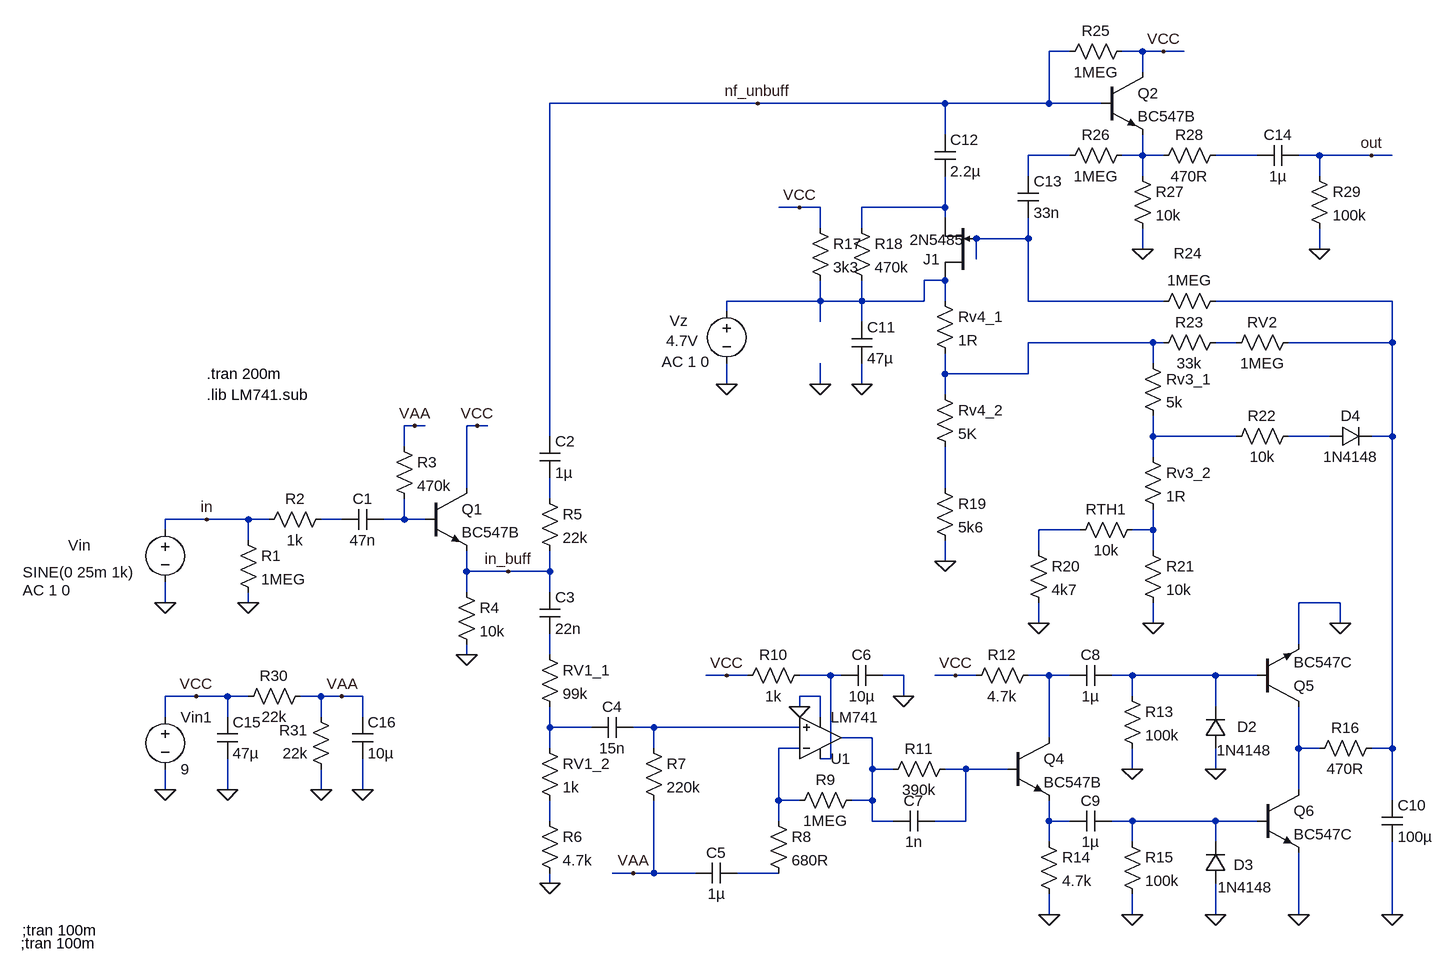
[diagram p0: schematic NF-1.asc]
NF-1.asc, the LTspice schematic file:
Version 4
SHEET 1 1268 920
WIRE 640 -496 608 -496
WIRE 752 -496 720 -496
WIRE 784 -496 752 -496
WIRE 816 -496 784 -496
WIRE 752 -464 752 -496
WIRE 160 -416 -160 -416
WIRE 448 -416 160 -416
WIRE 608 -416 608 -496
WIRE 608 -416 448 -416
WIRE 688 -416 608 -416
WIRE 448 -368 448 -416
WIRE 640 -336 576 -336
WIRE 752 -336 752 -368
WIRE 752 -336 720 -336
WIRE 784 -336 752 -336
WIRE 928 -336 864 -336
WIRE 1024 -336 992 -336
WIRE 1104 -336 1024 -336
WIRE 1136 -336 1104 -336
WIRE 576 -304 576 -336
WIRE 752 -304 752 -336
WIRE 1024 -304 1024 -336
WIRE 224 -256 192 -256
WIRE 256 -256 224 -256
WIRE 448 -256 448 -304
WIRE 448 -256 320 -256
WIRE 448 -240 448 -256
WIRE 256 -224 256 -256
WIRE 320 -224 320 -256
WIRE 576 -208 576 -240
WIRE 576 -208 496 -208
WIRE 752 -192 752 -224
WIRE 1024 -192 1024 -224
WIRE 496 -176 496 -208
WIRE 448 -144 416 -144
WIRE 256 -112 256 -144
WIRE 256 -112 112 -112
WIRE 320 -112 320 -144
WIRE 320 -112 256 -112
WIRE 416 -112 416 -144
WIRE 416 -112 320 -112
WIRE 448 -112 448 -144
WIRE 576 -112 576 -208
WIRE 784 -112 576 -112
WIRE 1136 -112 864 -112
WIRE 112 -96 112 -112
WIRE 256 -80 256 -112
WIRE 320 -80 320 -112
WIRE 768 -48 576 -48
WIRE 784 -48 768 -48
WIRE 896 -48 864 -48
WIRE 1136 -48 1136 -112
WIRE 1136 -48 976 -48
WIRE 768 -16 768 -48
WIRE 448 0 448 -32
WIRE 576 0 576 -48
WIRE 576 0 448 0
WIRE 112 16 112 -16
WIRE 256 16 256 -16
WIRE 320 16 320 -16
WIRE 448 32 448 0
WIRE -368 80 -384 80
WIRE -352 80 -368 80
WIRE -272 80 -288 80
WIRE -256 80 -272 80
WIRE -160 96 -160 -416
WIRE 768 96 768 64
WIRE 896 96 768 96
WIRE 1040 96 976 96
WIRE 1136 96 1136 -48
WIRE 1136 96 1104 96
WIRE -384 112 -384 80
WIRE 768 128 768 96
WIRE -288 176 -288 80
WIRE 448 176 448 112
WIRE -160 192 -160 160
WIRE -688 224 -752 224
WIRE -624 224 -688 224
WIRE -592 224 -624 224
WIRE -480 224 -512 224
WIRE -384 224 -384 192
WIRE -384 224 -416 224
WIRE -352 224 -384 224
WIRE -752 240 -752 224
WIRE 656 240 592 240
WIRE 768 240 768 208
WIRE 768 240 736 240
WIRE -624 256 -624 224
WIRE 592 272 592 240
WIRE 768 272 768 240
WIRE 448 288 448 256
WIRE -288 304 -288 272
WIRE -224 304 -288 304
WIRE -160 304 -160 272
WIRE -160 304 -224 304
WIRE -288 336 -288 304
WIRE -160 336 -160 304
WIRE -752 352 -752 320
WIRE -624 352 -624 336
WIRE 1056 352 992 352
WIRE 592 384 592 352
WIRE 768 384 768 352
WIRE 1056 384 1056 352
WIRE 992 416 992 352
WIRE -288 432 -288 416
WIRE -160 432 -160 400
WIRE 112 464 80 464
WIRE 144 464 112 464
WIRE 272 464 224 464
WIRE 288 464 272 464
WIRE 384 464 352 464
WIRE 464 464 432 464
WIRE 496 464 464 464
WIRE 608 464 576 464
WIRE 640 464 608 464
WIRE 736 464 704 464
WIRE 864 464 736 464
WIRE 928 464 864 464
WIRE -704 496 -752 496
WIRE -656 496 -704 496
WIRE -624 496 -656 496
WIRE -512 496 -544 496
WIRE -480 496 -512 496
WIRE -448 496 -480 496
WIRE 256 496 224 496
WIRE 384 496 384 464
WIRE 736 496 736 464
WIRE 224 512 224 496
WIRE 864 512 864 464
WIRE -752 528 -752 496
WIRE -656 528 -656 496
WIRE -512 528 -512 496
WIRE -448 528 -448 496
WIRE 256 528 256 496
WIRE -160 544 -160 512
WIRE -96 544 -160 544
WIRE 0 544 -32 544
WIRE 224 544 0 544
WIRE 336 560 288 560
WIRE 608 560 608 464
WIRE -160 576 -160 544
WIRE 0 576 0 544
WIRE 224 576 192 576
WIRE 992 576 992 512
WIRE 1024 576 992 576
WIRE 1136 576 1136 96
WIRE 1136 576 1104 576
WIRE 272 592 272 464
WIRE 272 592 256 592
WIRE 336 608 336 560
WIRE 368 608 336 608
WIRE 480 608 448 608
WIRE 544 608 480 608
WIRE 736 608 736 576
WIRE 864 608 864 576
WIRE -752 640 -752 608
WIRE -656 640 -656 592
WIRE -512 640 -512 608
WIRE -448 640 -448 592
WIRE 992 640 992 576
WIRE 192 656 192 576
WIRE 224 656 192 656
WIRE 336 656 336 608
WIRE 336 656 304 656
WIRE 1136 656 1136 576
WIRE -160 688 -160 656
WIRE 192 688 192 656
WIRE 336 688 336 656
WIRE 368 688 336 688
WIRE 480 688 480 608
WIRE 480 688 432 688
WIRE 608 688 608 656
WIRE 640 688 608 688
WIRE 736 688 704 688
WIRE 864 688 736 688
WIRE 928 688 864 688
WIRE 608 720 608 688
WIRE 736 720 736 688
WIRE 864 720 864 688
WIRE -32 768 -64 768
WIRE 0 768 0 656
WIRE 0 768 -32 768
WIRE 64 768 0 768
WIRE 192 768 128 768
WIRE -160 784 -160 768
WIRE 608 832 608 800
WIRE 736 832 736 800
WIRE 864 832 864 784
WIRE 992 832 992 736
WIRE 1136 832 1136 720
FLAG -624 352 0
FLAG -368 80 VAA
FLAG -288 432 0
FLAG -752 352 0
FLAG -272 80 VCC
FLAG -160 784 0
FLAG -32 768 VAA
FLAG 112 464 VCC
FLAG 384 496 0
FLAG -752 640 0
FLAG -656 640 0
FLAG -512 640 0
FLAG -480 496 VAA
FLAG -704 496 VCC
FLAG -448 640 0
FLAG 608 832 0
FLAG 736 832 0
FLAG 864 608 0
FLAG 864 832 0
FLAG 736 608 0
FLAG 464 464 VCC
FLAG 992 832 0
FLAG 1056 384 0
FLAG 1136 832 0
FLAG 224 512 0
FLAG 256 16 0
FLAG 320 16 0
FLAG 224 -256 VCC
FLAG 160 -416 nf_unbuff
FLAG -688 224 in
FLAG -224 304 in_buff
FLAG 752 -192 0
FLAG 1024 -192 0
FLAG 1104 -336 out
FLAG 784 -496 VCC
FLAG 768 384 0
FLAG 592 384 0
FLAG 112 16 0
FLAG 448 288 0
SYMBOL res -640 240 R0
SYMATTR InstName R1
SYMATTR Value 1MEG
SYMBOL res -496 208 R90
WINDOW 0 0 56 VBottom 2
WINDOW 3 32 56 VTop 2
SYMATTR InstName R2
SYMATTR Value 1k
SYMBOL cap -416 208 R90
WINDOW 0 0 32 VBottom 2
WINDOW 3 32 32 VTop 2
SYMATTR InstName C1
SYMATTR Value 47n
SYMBOL res -400 96 R0
SYMATTR InstName R3
SYMATTR Value 470k
SYMBOL npn -352 176 R0
SYMATTR InstName Q1
SYMATTR Value BC547B
SYMBOL res -304 320 R0
SYMATTR InstName R4
SYMATTR Value 10k
SYMBOL voltage -752 224 R0
WINDOW 0 -149 40 Left 2
WINDOW 3 -219 81 Left 2
WINDOW 123 -219 109 Left 2
WINDOW 39 0 0 Left 2
SYMATTR InstName Vin
SYMATTR Value SINE(0 25m 1k)
SYMATTR Value2 AC 1 0
SYMBOL cap -176 336 R0
SYMATTR InstName C3
SYMATTR Value 22n
SYMBOL res -176 416 R0
SYMATTR InstName RV1_1
SYMATTR Value 99k
SYMBOL res -176 560 R0
SYMATTR InstName RV1_2
SYMATTR Value 1k
SYMBOL cap -32 528 R90
WINDOW 0 0 32 VBottom 2
WINDOW 3 32 32 VTop 2
SYMATTR InstName C4
SYMATTR Value 15n
SYMBOL res -16 560 R0
SYMATTR InstName R7
SYMATTR Value 220k
SYMBOL res -176 672 R0
SYMATTR InstName R6
SYMATTR Value 4.7k
SYMBOL cap 128 752 R90
WINDOW 0 0 32 VBottom 2
WINDOW 3 32 32 VTop 2
SYMATTR InstName C5
SYMATTR Value 1µ
SYMBOL res 176 672 R0
SYMATTR InstName R8
SYMATTR Value 680R
SYMBOL res 320 640 R90
WINDOW 0 0 56 VBottom 2
WINDOW 3 32 56 VTop 2
SYMATTR InstName R9
SYMATTR Value 1MEG
SYMBOL Opamps\\opamp2 256 624 M180
SYMATTR InstName U1
SYMATTR Value LM741
SYMBOL res 240 448 R90
WINDOW 0 0 56 VBottom 2
WINDOW 3 32 56 VTop 2
SYMATTR InstName R10
SYMATTR Value 1k
SYMBOL cap 352 448 R90
WINDOW 0 0 32 VBottom 2
WINDOW 3 32 32 VTop 2
SYMATTR InstName C6
SYMATTR Value 10µ
SYMBOL res 464 592 R90
WINDOW 0 0 56 VBottom 2
WINDOW 3 32 56 VTop 2
SYMATTR InstName R11
SYMATTR Value 390k
SYMBOL cap 432 672 R90
WINDOW 0 0 32 VBottom 2
WINDOW 3 32 32 VTop 2
SYMATTR InstName C7
SYMATTR Value 1n
SYMBOL voltage -752 512 R0
WINDOW 123 0 0 Left 2
WINDOW 39 0 0 Left 2
SYMATTR InstName Vin1
SYMATTR Value 9
SYMBOL cap -672 528 R0
SYMATTR InstName C15
SYMATTR Value 47µ
SYMBOL res -528 480 R90
WINDOW 0 0 56 VBottom 2
WINDOW 3 32 56 VTop 2
SYMATTR InstName R30
SYMATTR Value 22k
SYMBOL res -496 624 R180
WINDOW 0 36 76 Left 2
WINDOW 3 36 40 Left 2
SYMATTR InstName R31
SYMATTR Value 22k
SYMBOL cap -464 528 R0
SYMATTR InstName C16
SYMATTR Value 10µ
SYMBOL npn 544 560 R0
SYMATTR InstName Q4
SYMATTR Value BC547B
SYMBOL res 592 704 R0
SYMATTR InstName R14
SYMATTR Value 4.7k
SYMBOL cap 704 672 R90
WINDOW 0 0 32 VBottom 2
WINDOW 3 32 32 VTop 2
SYMATTR InstName C9
SYMATTR Value 1µ
SYMBOL res 720 704 R0
SYMATTR InstName R15
SYMATTR Value 100k
SYMBOL diode 880 784 R180
WINDOW 0 -43 29 Left 2
WINDOW 3 -72 -6 Left 2
SYMATTR InstName D3
SYMATTR Value 1N4148
SYMBOL diode 880 576 R180
WINDOW 0 -48 33 Left 2
WINDOW 3 -71 -3 Left 2
SYMATTR InstName D2
SYMATTR Value 1N4148
SYMBOL res 720 480 R0
SYMATTR InstName R13
SYMATTR Value 100k
SYMBOL cap 704 448 R90
WINDOW 0 0 32 VBottom 2
WINDOW 3 32 32 VTop 2
SYMATTR InstName C8
SYMATTR Value 1µ
SYMBOL npn 928 640 R0
SYMATTR InstName Q6
SYMATTR Value BC547C
SYMBOL npn 928 512 M180
SYMATTR InstName Q5
SYMATTR Value BC547C
SYMBOL res 592 448 R90
WINDOW 0 0 56 VBottom 2
WINDOW 3 32 56 VTop 2
SYMATTR InstName R12
SYMATTR Value 4.7k
SYMBOL res 1120 560 R90
WINDOW 0 0 56 VBottom 2
WINDOW 3 32 56 VTop 2
SYMATTR InstName R16
SYMATTR Value 470R
SYMBOL cap 1120 656 R0
SYMATTR InstName C10
SYMATTR Value 100µ
SYMBOL res -176 176 R0
SYMATTR InstName R5
SYMATTR Value 22k
SYMBOL cap -176 96 R0
SYMATTR InstName C2
SYMATTR Value 1µ
SYMBOL cap 304 -80 R0
SYMATTR InstName C11
SYMATTR Value 47µ
SYMBOL res 240 -240 R0
SYMATTR InstName R17
SYMATTR Value 3k3
SYMBOL res 304 -240 R0
SYMATTR InstName R18
SYMATTR Value 470k
SYMBOL njf 496 -144 R180
WINDOW 3 18 62 Left 2
SYMATTR InstName J1
SYMATTR Value 2N5485
SYMBOL res 432 -128 R0
SYMATTR InstName Rv4_1
SYMATTR Value 1R
SYMBOL res 432 16 R0
SYMATTR InstName Rv4_2
SYMATTR Value 5K
SYMBOL cap 432 -368 R0
SYMATTR InstName C12
SYMATTR Value 2.2µ
SYMBOL cap 560 -304 R0
SYMATTR InstName C13
SYMATTR Value 33n
SYMBOL res 736 -352 R90
WINDOW 0 0 56 VBottom 2
WINDOW 3 32 56 VTop 2
SYMATTR InstName R26
SYMATTR Value 1MEG
SYMBOL res 736 -320 R0
SYMATTR InstName R27
SYMATTR Value 10k
SYMBOL res 880 -352 R90
WINDOW 0 0 56 VBottom 2
WINDOW 3 32 56 VTop 2
SYMATTR InstName R28
SYMATTR Value 470R
SYMBOL cap 992 -352 R90
WINDOW 0 0 32 VBottom 2
WINDOW 3 32 32 VTop 2
SYMATTR InstName C14
SYMATTR Value 1µ
SYMBOL res 1008 -320 R0
SYMATTR InstName R29
SYMATTR Value 100k
SYMBOL npn 688 -464 R0
SYMATTR InstName Q2
SYMATTR Value BC547B
SYMBOL res 736 -512 R90
WINDOW 0 0 56 VBottom 2
WINDOW 3 32 56 VTop 2
SYMATTR InstName R25
SYMATTR Value 1MEG
SYMBOL res 880 -128 R90
WINDOW 0 -42 58 VBottom 2
WINDOW 3 -32 56 VTop 2
SYMATTR InstName R24
SYMATTR Value 1MEG
SYMBOL res 880 -64 R90
WINDOW 0 0 56 VBottom 2
WINDOW 3 32 56 VTop 2
SYMATTR InstName R23
SYMATTR Value 33k
SYMBOL res 752 -32 R0
SYMATTR InstName Rv3_1
SYMATTR Value 5k
SYMBOL res 752 112 R0
SYMATTR InstName Rv3_2
SYMATTR Value 1R
SYMBOL res 752 224 R90
WINDOW 0 0 56 VBottom 2
WINDOW 3 32 56 VTop 2
SYMATTR InstName RTH1
SYMATTR Value 10k
SYMBOL res 576 256 R0
SYMATTR InstName R20
SYMATTR Value 4k7
SYMBOL res 752 256 R0
SYMATTR InstName R21
SYMATTR Value 10k
SYMBOL res 992 80 R90
WINDOW 0 0 56 VBottom 2
WINDOW 3 32 56 VTop 2
SYMATTR InstName R22
SYMATTR Value 10k
SYMBOL diode 1040 112 R270
WINDOW 0 32 32 VTop 2
WINDOW 3 0 32 VBottom 2
SYMATTR InstName D4
SYMATTR Value 1N4148
SYMBOL res 992 -64 R90
WINDOW 0 0 56 VBottom 2
WINDOW 3 32 56 VTop 2
SYMATTR InstName RV2
SYMATTR Value 1MEG
SYMBOL voltage 112 -112 R0
WINDOW 0 -88 30 Left 2
WINDOW 3 -93 61 Left 2
WINDOW 123 -100 93 Left 2
WINDOW 39 0 0 Left 2
SYMATTR InstName Vz
SYMATTR Value 4.7V
SYMATTR Value2 AC 1 0
SYMBOL res 432 160 R0
SYMATTR InstName R19
SYMATTR Value 5k6
TEXT -688 0 Left 2 !.tran 200m
TEXT -688 32 Left 2 !.lib LM741.sub
TEXT -972 856 Left 2 !;tran 100m
TEXT -974 876 Left 2 !;tran 100m

The netlist it stands for:
* NF-1.asc
R1 in 0 1MEG
R2 N014 in 1k
C1 N015 N014 47n
R3 VAA N015 470k
Q1 VCC N015 in_buff 0 BC547B
R4 in_buff 0 10k
Vin in 0 SINE(0 25m 1k) AC 1 0
C3 in_buff N018 22n
RV1_1 N018 N022 99k
RV1_2 N022 N028 1k
C4 N023 N022 15n
R7 N023 VAA 220k
R6 N028 0 4.7k
C5 N031 VAA 1µ
R8 N025 N031 680R
R9 N024 N025 1MEG
XU1 N023 N025 N019 0 N024 LM741  ; pins In+ In- V+ V- OUT
R10 N019 VCC 1k
C6 0 N019 10µ
R11 N027 N024 390k
C7 N027 N024 1n
Vin1 VCC 0 9
C15 VCC 0 47µ
R30 VAA VCC 22k
R31 0 VAA 22k
C16 VAA 0 10µ
Q4 N020 N027 N029 0 BC547B
R14 N029 0 4.7k
C9 N030 N029 1µ
R15 N030 0 100k
D3 0 N030 1N4148
D2 0 N021 1N4148
R13 N021 0 100k
C8 N021 N020 1µ
Q6 N026 N030 0 0 BC547C
Q5 N026 N021 0 0 BC547C
R12 N020 VCC 4.7k
R16 N007 N026 470R
C10 N007 0 100µ
R5 N013 in_buff 22k
C2 nf_unbuff N013 1µ
C11 N006 0 47µ
R17 VCC N006 3k3
R18 N004 N006 470k
J1 N006 N005 N004 2N5485
Rv4_1 N006 N008 1R
Rv4_2 N008 N012 5K
C12 nf_unbuff N004 2.2µ
C13 N001 N005 33n
R26 N002 N001 1MEG
R27 N002 0 10k
R28 N003 N002 470R
C14 out N003 1µ
R29 out 0 100k
Q2 VCC nf_unbuff N002 0 BC547B
R25 VCC nf_unbuff 1MEG
R24 N007 N005 1MEG
R23 N009 N008 33k
Rv3_1 N008 N010 5k
Rv3_2 N010 N017 1R
RTH1 N017 N016 10k
R20 N016 0 4k7
R21 N017 0 10k
R22 N011 N010 10k
D4 N011 N007 1N4148
RV2 N007 N009 1MEG
Vz N006 0 4.7V AC 1 0
R19 N012 0 5k6
.model D D
.lib standard.dio
.model NPN NPN
.model PNP PNP
.lib standard.bjt
.model NJF NJF
.model PJF PJF
.lib standard.jft
.tran 200m
.lib LM741.sub
;tran 100m
;tran 100m
.backanno
.end